# EAGLE design console1 (EAGLE 8.0.2)
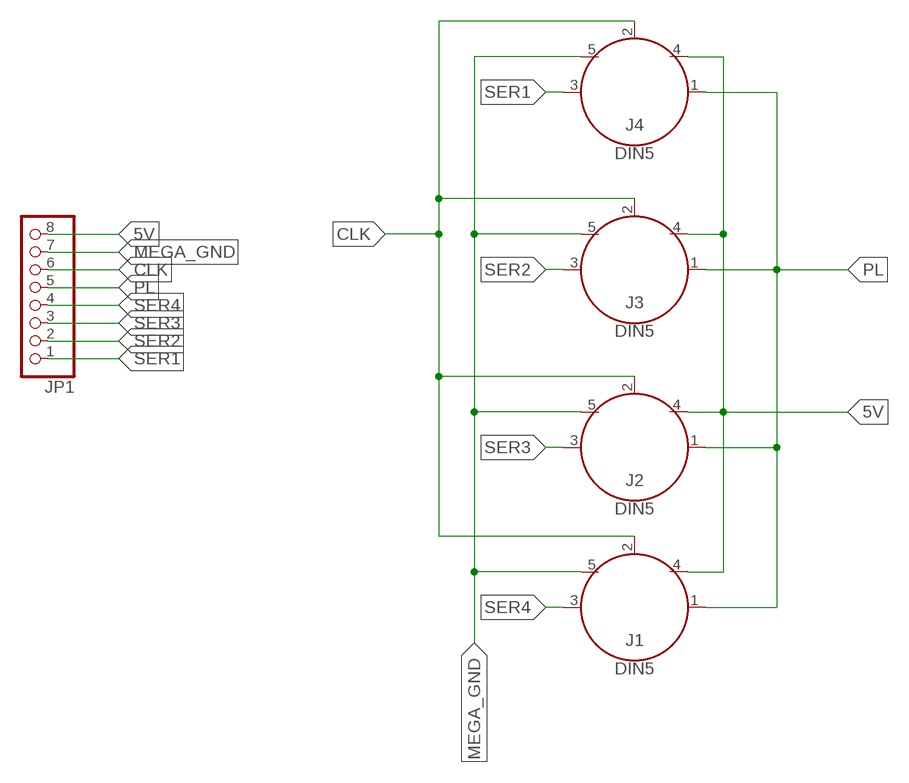
[diagram p0: schematic, sheet 1]

## Parts
J1  DIN5  [DIN5-RA-PTH]
J2  DIN5  [DIN5-RA-PTH]
J3  DIN5  [DIN5-RA-PTH]
J4  DIN5  [DIN5-RA-PTH]
JP1  PINHD-1X8  [1X08]

## Nets
5V: J1.4 J2.4 J3.4 J4.4 JP1.8
CLK: J1.2 J2.2 J3.2 J4.2 JP1.6
MEGA_GND: J1.5 J2.5 J3.5 J4.5 JP1.7
PL: J1.1 J2.1 J3.1 J4.1 JP1.5
SER1: J4.3 JP1.1
SER2: J3.3 JP1.2
SER3: J2.3 JP1.3
SER4: J1.3 JP1.4

## Library data of the parts
J1-J4 = SparkFun-Connectors:DIN5: DIN5 Connector - Female Right Angle (frequently used as a MIDI Jack connector) This type of connector and cable is frequently used for transmitting midi data (musical instrument digital interface). It is what you usually see on a keyboard or set of electronic drums. Learn more here <https://en.wikipedia.org/wiki/MIDI>. For more information on the pinout and electrical specifications of MIDI communications, please see the following resource: https://www.midi.org/specifications/item/midi-din-electrical-specification Here is the connector we sell at SparkFun: MIDI Connector - Female Right Angle <https://www.sparkfun.com/products/9536> (PRT-09536) Datasheet <hhttp://www.sparkfun.com/datasheets/Prototyping/Connectors/MIDI-RA.pdf> It is used on this SparkFun product: SparkFun MIDI Shield <https://www.sparkfun.com/products/12898> (DEV-12898); PROD_ID: CONN-09481
JP1 = pinhead:PINHD-1X8: PIN HEADER

## Board
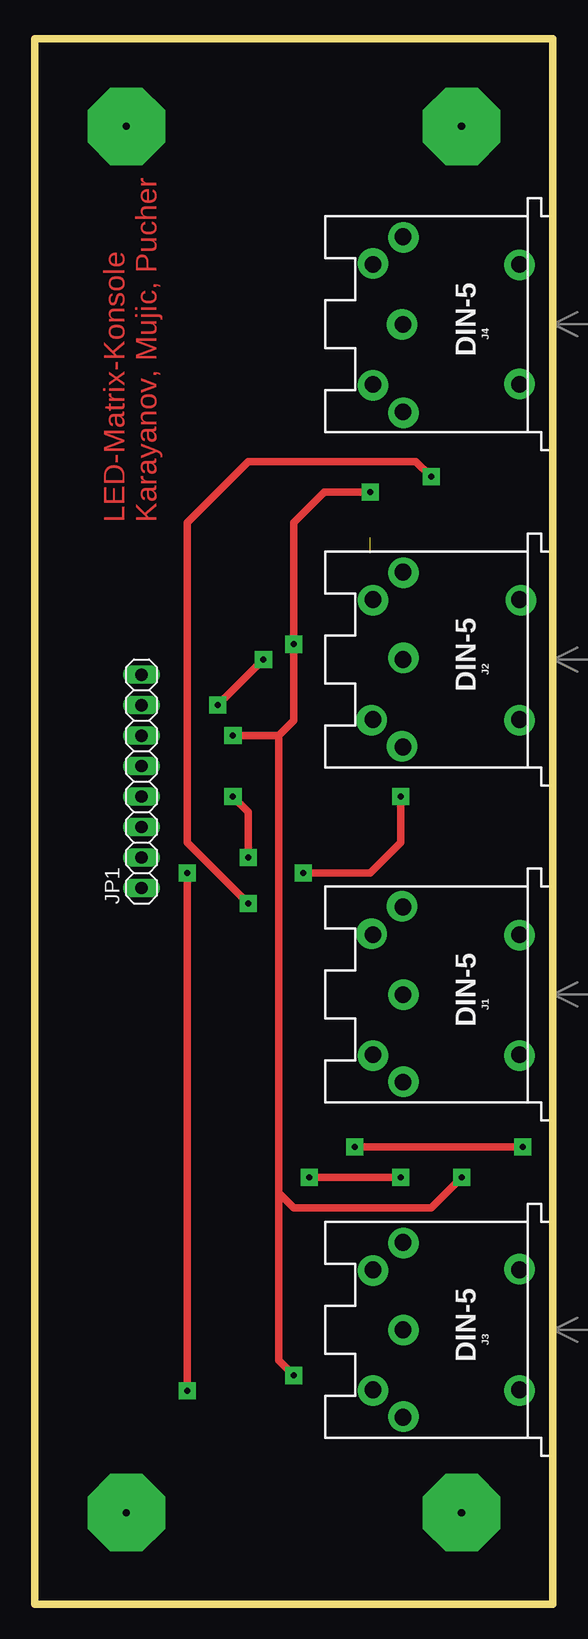
[diagram p1: board, top side]
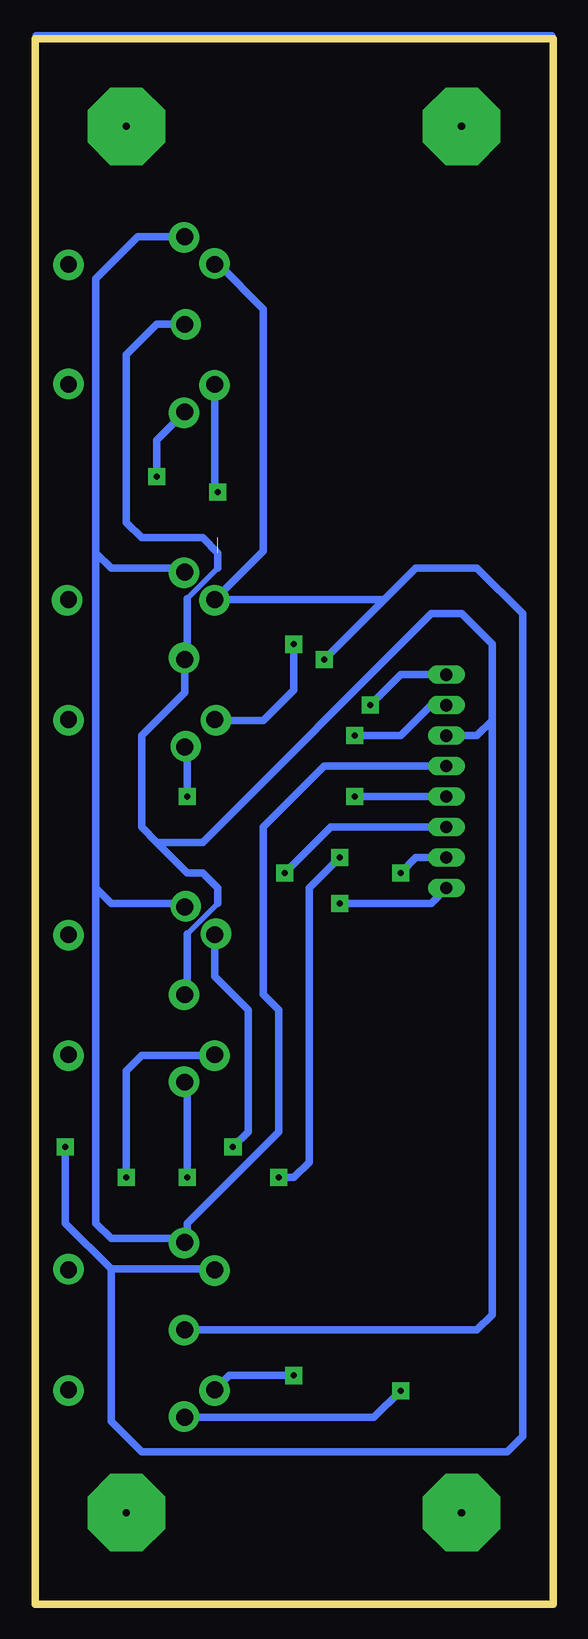
[diagram p2: board, bottom side, seen from below]

Size 43.16 x 130.48 mm. Coordinates in mm from the lower left corner, seen from the top.
Outline: 0,0 43.16,0 43.16,130.48 0,130.48 0,0
Copper layers (1*16): Top 0.035mm / dielectric 1.5mm / Bottom 0.035mm
Design rules "default": minimum track width 10mil, minimum drill 24mil, track to track 8mil, track to pad 8mil, pad to pad 8mil, via to via 8mil, smd to smd 8mil, copper to edge 40mil, drill to drill 8mil, minimum pad ring 10mil, minimum via ring 8mil, stop-mask expansion 4mil, vias tented up to drill 0mil, thermal gap 10mil

### Footprints (pad centres in the part's own frame; a part is rotated, then mirrored left to right if it is on the bottom)
DIN5-RA-PTH = drill 1.4 pad 2.286: 1 7.3,12.5; 2 0,12.5; 3 -7.3,12.5; 4 5,15; 5 -5,15; 6 -5,2.8; 7 5,2.8
1X08 = drill 1.016 long: 1 -8.89,0; 2 -6.35,0; 3 -3.81,0; 4 -1.27,0; 5 1.27,0; 6 3.81,0; 7 6.35,0; 8 8.89,0

### Placement (x,y rotation side)
J1  43.18,50.8 90 top
J2  43.18,78.74 90 top
J3  43.18,22.86 90 top
J4  43.18,106.68 90 top
JP1  8.89,68.58 90 top

### Tracks (layer width: path | path; a pad name or v marks a point on that pad's centre or on a via)
5V  (via drill 0.5 pad 1.42)
  Top 0.61: v19.05,78.74 v15.24,74.93 | v40.64,38.1 v26.67,38.1
  Bottom 0.61: J4.4 27.86,111.68 24.13,107.95 24.13,87.79 J2.4 14.05,83.74 | 14.05,83.74 11.43,86.36 6.35,86.36 2.54,82.55 2.54,13.97 3.81,12.7 34.29,12.7 36.83,15.24 36.83,27.94 | J3.4 28.26,27.94 36.83,27.94 | 14.05,83.74 v19.05,78.74 | v15.24,74.93 12.7,77.47 JP1.8 | J1.4 28.18,52.31 25.4,49.53 25.4,39.37 v26.67,38.1 | v40.64,38.1 40.64,31.75 36.83,27.94
CLK  (1 unrouted)
  Bottom 0.406: 27.94,86.36 30.48,83.82 | 27.94,58.42 30.48,55.88
  Bottom 0.61: J4.2 33.02,106.68 35.56,104.14 35.56,90.17 34.29,88.9 29.21,88.9 27.94,87.63 27.94,86.36 | 30.48,83.82 30.48,78.94 J2.2 | J2.2 30.68,78.54 | 27.94,58.42 27.94,59.69 29.21,60.96 30.48,60.96 33.02,63.5 | 30.48,55.88 30.48,51 J1.2 | 5.08,73.66 5.08,80.01 7.62,82.55 10.16,82.55 29.21,63.5 33.02,63.5 | 5.08,73.66 5.08,24.13 6.35,22.86 J3.2 | 5.08,73.66 6.35,72.39 JP1.6 | J2.2 30.68,76 34.29,72.39 34.29,64.77 33.02,63.5
MEGA_GND  (via drill 0.5 pad 1.42, 0.5 pad 2.54)
  Top 0.61: 20.32,34.29 20.32,20.32 v21.59,19.05 | 20.32,34.29 21.59,33.02 33.02,33.02 v35.56,35.56 | 20.32,72.39 21.59,73.66 v21.59,80.01 21.59,90.17 24.13,92.71 v27.94,92.71 | 20.32,34.29 20.32,72.39 | 20.32,72.39 v16.51,72.39
  Bottom 0.61: v21.59,80.01 21.59,76.2 24.13,73.66 v28.07,73.66 28.1,73.66 J2.5 | v35.56,35.56 35.56,44.45 34.29,45.72 28.26,45.72 J1.5 | v21.59,19.05 26.99,19.05 J3.5 | v27.94,92.71 28.18,92.95 J4.5 | JP1.7 10.16,74.93 12.7,72.39 v16.51,72.39
N$1  (via drill 0.6 pad 6.45)
  other vias: 7.62,7.62
N$2  (via drill 0.6 pad 6.45)
  other vias: 35.56,7.62
N$3  (via drill 0.6 pad 6.45)
  other vias: 7.62,123.19
N$4  (via drill 0.6 pad 6.45)
  other vias: 35.56,123.19
N$5
  Bottom 0.406: 0,130.81 43.18,130.81 43.18,0 0,0 0,130.81
N$6  (via drill 0.5 pad 2.54)
  other vias: 30.73,113.92
N$7  (via drill 0.5 pad 2.54)
  other vias: 28.19,111.76
N$8  (via drill 0.5 pad 2.54)
  other vias: 40.39,111.63
N$9  (via drill 0.5 pad 2.54)
  other vias: 40.39,101.73
N$10  (via drill 0.5 pad 2.54)
  other vias: 30.61,106.68
N$11  (via drill 0.5 pad 2.54)
  other vias: 28.19,101.6
N$12  (via drill 0.5 pad 2.54)
  other vias: 30.73,99.31
N$13  (via drill 0.5 pad 2.54)
  other vias: 30.73,85.98
N$14  (via drill 0.5 pad 2.54)
  other vias: 40.51,83.69
N$15  (via drill 0.5 pad 2.54)
  other vias: 28.19,83.69
N$16  (via drill 0.5 pad 2.54)
  other vias: 30.73,78.87
N$17  (via drill 0.5 pad 2.54)
  other vias: 40.39,73.66
N$18  (via drill 0.5 pad 2.54)
  other vias: 30.61,71.5
N$19  (via drill 0.5 pad 2.54)
  other vias: 30.61,58.17
N$20  (via drill 0.5 pad 2.54)
  other vias: 28.07,55.88
N$21  (via drill 0.5 pad 2.54)
  other vias: 40.39,55.75
N$22  (via drill 0.5 pad 2.54)
  other vias: 30.73,50.8
N$23  (via drill 0.5 pad 2.54)
  other vias: 28.19,45.72
N$24  (via drill 0.5 pad 2.54)
  other vias: 40.39,45.72
N$25  (via drill 0.5 pad 2.54)
  other vias: 30.73,43.56
N$26  (via drill 0.5 pad 2.54)
  other vias: 30.73,30.1
N$27  (via drill 0.5 pad 2.54)
  other vias: 28.19,27.81
N$28  (via drill 0.5 pad 2.54)
  other vias: 40.39,27.94
N$29  (via drill 0.5 pad 2.54)
  other vias: 30.73,22.86
N$30  (via drill 0.5 pad 2.54)
  other vias: 28.19,17.78
N$31  (via drill 0.5 pad 2.54)
  other vias: 30.73,15.62
N$32  (via drill 0.5 pad 2.54)
  other vias: 40.39,17.78
PL
  Bottom 0.61: J4.1 34.61,113.98 38.1,110.49 38.1,87.63 | 38.1,87.63 36.83,86.36 31,86.36 J2.1 | 38.1,87.63 38.1,59.69 | 38.1,59.69 36.83,58.42 31,58.42 J1.1 | 38.1,59.69 38.1,31.75 36.83,30.48 31,30.48 J3.1 30.48,30.36 30.48,31.75 22.86,39.37 22.86,49.53 24.13,50.8 24.13,64.77 19.05,69.85 JP1.5
SER1  (via drill 0.5 pad 1.42)
  Top 0.61: v33.02,93.98 31.75,95.25 17.78,95.25 12.7,90.17 12.7,63.5 v17.78,58.42
  Bottom 0.61: v17.78,58.42 10.16,58.42 JP1.1 | J4.3 33.02,97.04 v33.02,93.98
SER2  (via drill 0.5 pad 1.42)
  Top 0.61: v12.7,60.96 v12.7,17.78
  Bottom 0.61: J3.3 14.92,15.56 v12.7,17.78 | v12.7,60.96 11.43,62.23 JP1.2
SER3  (via drill 0.5 pad 1.42)
  Top 0.61: v30.48,67.31 30.48,63.5 27.94,60.96 v22.35,60.96
  Bottom 0.61: J2.3 30.68,70.92 30.48,70.72 v30.48,67.31 | v22.35,60.96 18.54,64.77 JP1.3
SER4  (via drill 0.5 pad 1.42)
  Top 0.61: v30.48,35.56 v22.86,35.56 | v17.78,62.23 17.78,66.04 v16.51,67.31
  Bottom 0.61: v22.86,35.56 21.59,35.56 20.32,36.83 20.32,59.69 v17.78,62.23 | v16.51,67.31 JP1.4 | J1.3 30.48,43.3 v30.48,35.56

### Text on the board
Top: LED-Matrix-Konsole / Karayanov, Mujic, Pucher